# EAGLE design Multi-Channel-Thermocouple-Shield (EAGLE 6.3)
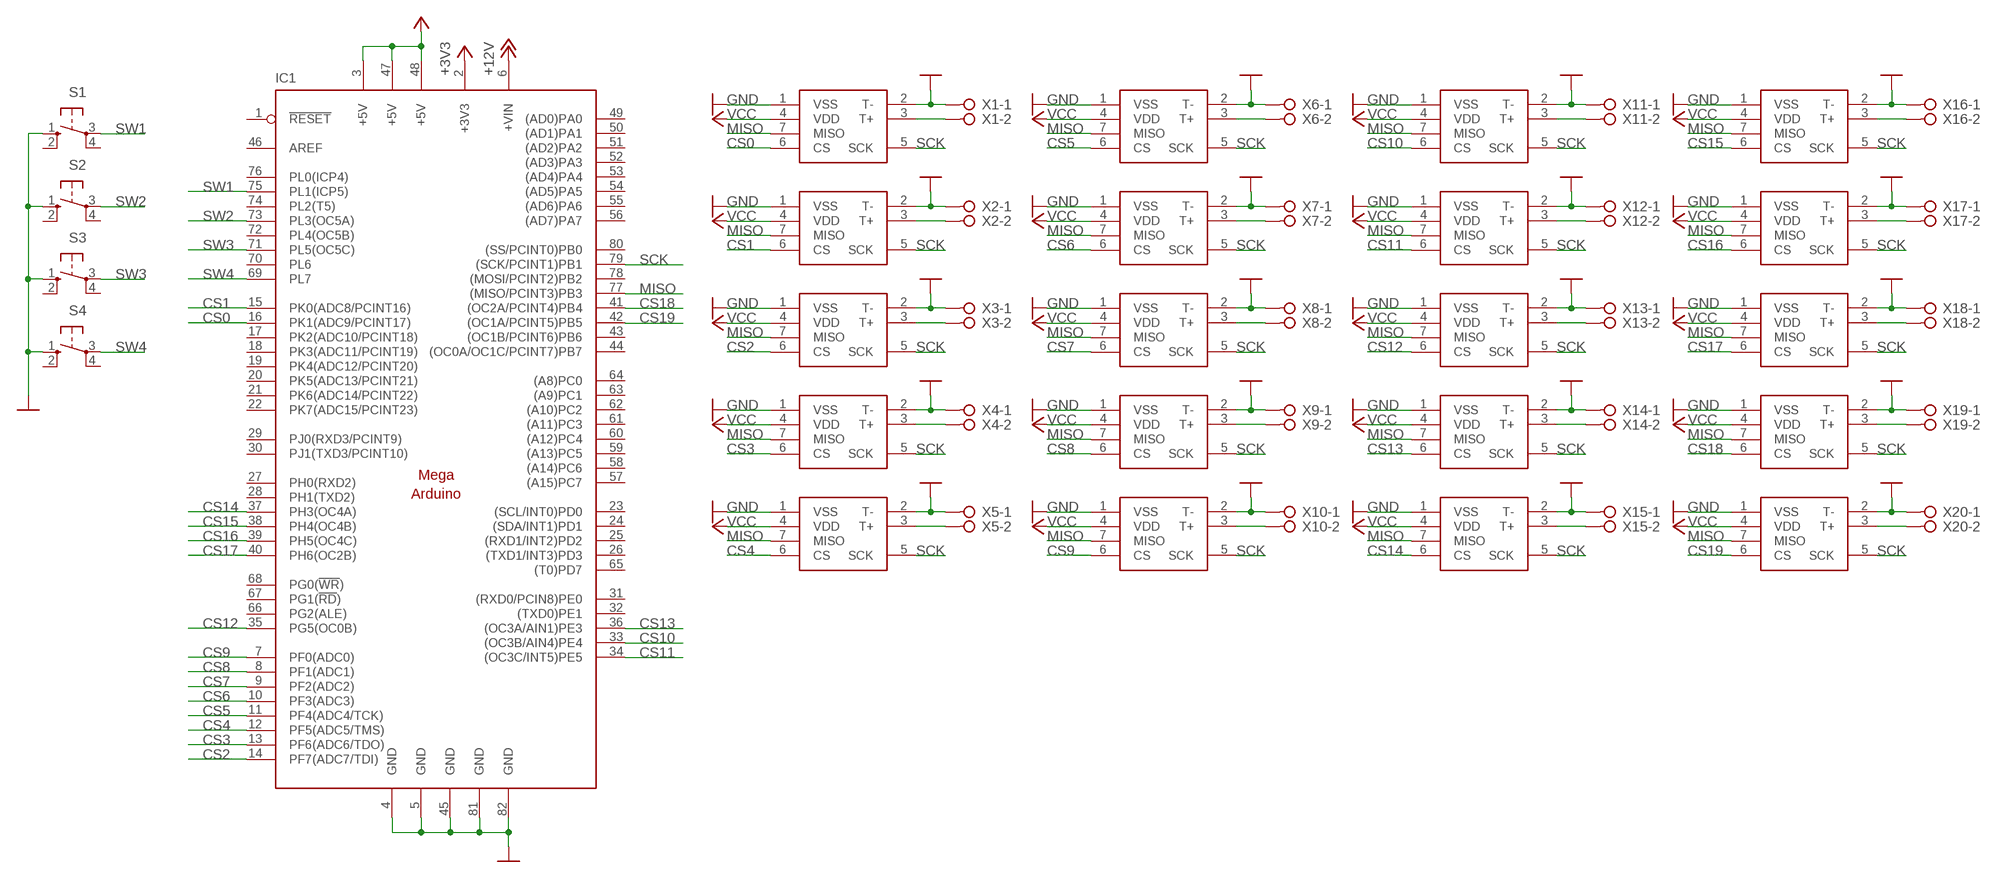
[diagram p0: schematic, sheet 1]

## Parts
IC1  ARDUINO_MEGA-SHIELD  [MEGA_ARDUINO]
S1  SW-PUSHBUTTON  [B3F-10XX]
S2  SW-PUSHBUTTON  [B3F-10XX]
S3  SW-PUSHBUTTON  [B3F-10XX]
S4  SW-PUSHBUTTON  [B3F-10XX]
U$1  MAX6675  [SO08]
U$2  MAX6675  [SO08]
U$3  MAX6675  [SO08]
U$4  MAX6675  [SO08]
U$5  MAX6675  [SO08]
U$6  MAX6675  [SO08]
U$7  MAX6675  [SO08]
U$8  MAX6675  [SO08]
U$9  MAX6675  [SO08]
U$10  MAX6675  [SO08]
U$11  MAX6675  [SO08]
U$12  MAX6675  [SO08]
U$13  MAX6675  [SO08]
U$14  MAX6675  [SO08]
U$15  MAX6675  [SO08]
U$16  MAX6675  [SO08]
U$17  MAX6675  [SO08]
U$18  MAX6675  [SO08]
U$19  MAX6675  [SO08]
U$20  MAX6675  [SO08]
X1  W237-02P  [W237-132]
X2  W237-02P  [W237-132]
X3  W237-02P  [W237-132]
X4  W237-02P  [W237-132]
X5  W237-02P  [W237-132]
X6  W237-02P  [W237-132]
X7  W237-02P  [W237-132]
X8  W237-02P  [W237-132]
X9  W237-02P  [W237-132]
X10  W237-02P  [W237-132]
X11  W237-02P  [W237-132]
X12  W237-02P  [W237-132]
X13  W237-02P  [W237-132]
X14  W237-02P  [W237-132]
X15  W237-02P  [W237-132]
X16  W237-02P  [W237-132]
X17  W237-02P  [W237-132]
X18  W237-02P  [W237-132]
X19  W237-02P  [W237-132]
X20  W237-02P  [W237-132]

## Nets
+3V3 [pwr]: IC1.2(+3V3)
+12V [pwr]: IC1.6(+VIN)
CS0: IC1.16(PK1(ADC9/PCINT17)) U$1.6(CS)
CS1: IC1.15(PK0(ADC8/PCINT16)) U$2.6(CS)
CS2: IC1.14(PF7(ADC7/TDI)) U$3.6(CS)
CS3: IC1.13(PF6(ADC6/TDO)) U$4.6(CS)
CS4: IC1.12(PF5(ADC5/TMS)) U$5.6(CS)
CS5: IC1.11(PF4(ADC4/TCK)) U$6.6(CS)
CS6: IC1.10(PF3(ADC3)) U$7.6(CS)
CS7: IC1.9(PF2(ADC2)) U$8.6(CS)
CS8: IC1.8(PF1(ADC1)) U$9.6(CS)
CS9: IC1.7(PF0(ADC0)) U$10.6(CS)
CS10: IC1.33((OC3B/AIN4)PE4) U$11.6(CS)
CS11: IC1.34((OC3C/INT5)PE5) U$12.6(CS)
CS12: IC1.35(PG5(OC0B)) U$13.6(CS)
CS13: IC1.36((OC3A/AIN1)PE3) U$14.6(CS)
CS14: IC1.37(PH3(OC4A)) U$15.6(CS)
CS15: IC1.38(PH4(OC4B)) U$16.6(CS)
CS16: IC1.39(PH5(OC4C)) U$17.6(CS)
CS17: IC1.40(PH6(OC2B)) U$18.6(CS)
CS18: IC1.41((OC2A/PCINT4)PB4) U$19.6(CS)
CS19: IC1.42((OC1A/PCINT5)PB5) U$20.6(CS)
GND [pwr]: IC1.4(GND) IC1.5(GND) IC1.45(GND) IC1.81(GND) IC1.82(GND) S1.1(S) S2.1(S) S3.1(S) S4.1(S) U$1.1(VSS) U$1.2(T-) U$2.1(VSS) U$2.2(T-) U$3.1(VSS) U$3.2(T-) U$4.1(VSS) U$4.2(T-) U$5.1(VSS) U$5.2(T-) U$6.1(VSS) U$6.2(T-) U$7.1(VSS) U$7.2(T-) U$8.1(VSS) U$8.2(T-) U$9.1(VSS) U$9.2(T-) U$10.1(VSS) U$10.2(T-) U$11.1(VSS) U$11.2(T-) U$12.1(VSS) U$12.2(T-) U$13.1(VSS) U$13.2(T-) U$14.1(VSS) U$14.2(T-) U$15.1(VSS) U$15.2(T-) U$16.1(VSS) U$16.2(T-) U$17.1(VSS) U$17.2(T-) U$18.1(VSS) U$18.2(T-) U$19.1(VSS) U$19.2(T-) U$20.1(VSS) U$20.2(T-) X1.1 X2.1 X3.1 X4.1 X5.1 X6.1 X7.1 X8.1 X9.1 X10.1 X11.1 X12.1 X13.1 X14.1 X15.1 X16.1 X17.1 X18.1 X19.1 X20.1
MISO: IC1.77((MISO/PCINT3)PB3) U$1.7(MISO) U$2.7(MISO) U$3.7(MISO) U$4.7(MISO) U$5.7(MISO) U$6.7(MISO) U$7.7(MISO) U$8.7(MISO) U$9.7(MISO) U$10.7(MISO) U$11.7(MISO) U$12.7(MISO) U$13.7(MISO) U$14.7(MISO) U$15.7(MISO) U$16.7(MISO) U$17.7(MISO) U$18.7(MISO) U$19.7(MISO) U$20.7(MISO)
N$2 [pwr]: U$10.3(T+) X10.2
N$4 [pwr]: U$1.3(T+) X1.2
N$6 [pwr]: U$2.3(T+) X2.2
N$7 [pwr]: U$3.3(T+) X3.2
N$11 [pwr]: U$4.3(T+) X4.2
N$13 [pwr]: U$5.3(T+) X5.2
N$14 [pwr]: U$6.3(T+) X6.2
N$17 [pwr]: U$7.3(T+) X7.2
N$18 [pwr]: U$8.3(T+) X8.2
N$21 [pwr]: U$9.3(T+) X9.2
N$23 [pwr]: U$11.3(T+) X11.2
N$25 [pwr]: U$12.3(T+) X12.2
N$27 [pwr]: U$13.3(T+) X13.2
N$29 [pwr]: U$14.3(T+) X14.2
N$31 [pwr]: U$15.3(T+) X15.2
N$34 [pwr]: U$16.3(T+) X16.2
N$36 [pwr]: U$17.3(T+) X17.2
N$38 [pwr]: U$18.3(T+) X18.2
N$39 [pwr]: U$19.3(T+) X19.2
N$42 [pwr]: U$20.3(T+) X20.2
SCK: IC1.79((SCK/PCINT1)PB1) U$1.5(SCK) U$2.5(SCK) U$3.5(SCK) U$4.5(SCK) U$5.5(SCK) U$6.5(SCK) U$7.5(SCK) U$8.5(SCK) U$9.5(SCK) U$10.5(SCK) U$11.5(SCK) U$12.5(SCK) U$13.5(SCK) U$14.5(SCK) U$15.5(SCK) U$16.5(SCK) U$17.5(SCK) U$18.5(SCK) U$19.5(SCK) U$20.5(SCK)
SW1: IC1.75(PL1(ICP5)) S1.3(P)
SW2: IC1.73(PL3(OC5A)) S2.3(P)
SW3: IC1.71(PL5(OC5C)) S3.3(P)
SW4: IC1.69(PL7) S4.3(P)
VCC [pwr]: IC1.3(+5V) IC1.47(+5V) IC1.48(+5V) U$1.4(VDD) U$2.4(VDD) U$3.4(VDD) U$4.4(VDD) U$5.4(VDD) U$6.4(VDD) U$7.4(VDD) U$8.4(VDD) U$9.4(VDD) U$10.4(VDD) U$11.4(VDD) U$12.4(VDD) U$13.4(VDD) U$14.4(VDD) U$15.4(VDD) U$16.4(VDD) U$17.4(VDD) U$18.4(VDD) U$19.4(VDD) U$20.4(VDD)
Unconnected: IC1.1(!RESET) IC1.17(PK2(ADC10/PCINT18)) IC1.18(PK3(ADC11/PCINT19)) IC1.19(PK4(ADC12/PCINT20)) IC1.20(PK5(ADC13/PCINT21)) IC1.21(PK6(ADC14/PCINT22)) IC1.22(PK7(ADC15/PCINT23)) IC1.23((SCL/INT0)PD0) IC1.24((SDA/INT1)PD1) IC1.25((RXD1/INT2)PD2) IC1.26((TXD1/INT3)PD3) IC1.27(PH0(RXD2)) IC1.28(PH1(TXD2)) IC1.29(PJ0(RXD3/PCINT9)) IC1.30(PJ1(TXD3/PCINT10)) IC1.31((RXD0/PCIN8)PE0) IC1.32((TXD0)PE1) IC1.43((OC1B/PCINT6)PB6) IC1.44((OC0A/OC1C/PCINT7)PB7) IC1.46(AREF) IC1.49((AD0)PA0) IC1.50((AD1)PA1) IC1.51((AD2)PA2) IC1.52((AD3)PA3) IC1.53((AD4)PA4) IC1.54((AD5)PA5) IC1.55((AD6)PA6) IC1.56((AD7)PA7) IC1.57((A15)PC7) IC1.58((A14)PC6) IC1.59((A13)PC5) IC1.60((A12)PC4) IC1.61((A11)PC3) IC1.62((A10)PC2) IC1.63((A9)PC1) IC1.64((A8)PC0) IC1.65((T0)PD7) IC1.66(PG2(ALE)) IC1.67(PG1(!RD!)) IC1.68(PG0(!WR!)) IC1.70(PL6) IC1.72(PL4(OC5B)) IC1.74(PL2(T5)) IC1.76(PL0(ICP4)) IC1.78((MOSI/PCINT2)PB2) IC1.80((SS/PCINT0)PB0) S1.2(S1) S1.4(P1) S2.2(S1) S2.4(P1) S3.2(S1) S3.4(P1) S4.2(S1) S4.4(P1)

## Library data of the parts
IC1 = barelang-store:ARDUINO_MEGA-SHIELD: The Arduino Mega is a microcontroller board based on the ATmega1280. - 54 digital input/output pins (of which 14 can be used as PWM outputs) - 16 analog inputs - 4 UARTs (hardware serial ports) - 16 MHz crystal oscillator - USB connection - power jack - ICSP header - reset button It contains everything needed to support the microcontroller; simply connect it to a computer with a USB cable or power it with a AC-to-DC adapter or battery to get started. The Mega is compatible with most shields designed for the Arduino Duemilanove or Diecimila. http://arduino.cc/en/Main/ArduinoBoardMega
S1-S4 = barelang-store:SW-PUSHBUTTON: OMRON SWITCH; MPN: B3F-1000; OC_FARNELL: 176432; OC_NEWARK: 36M3542
U$1-U$20 = max6675:MAX6675
X1-X20 = con-wago-508:W237-02P: WAGO SREW CLAMP; OC_FARNELL: unknown; OC_NEWARK: unknown

## Net classes
0 default: width 0.3 mm
1 pwr: width 0.5 mm

## Board
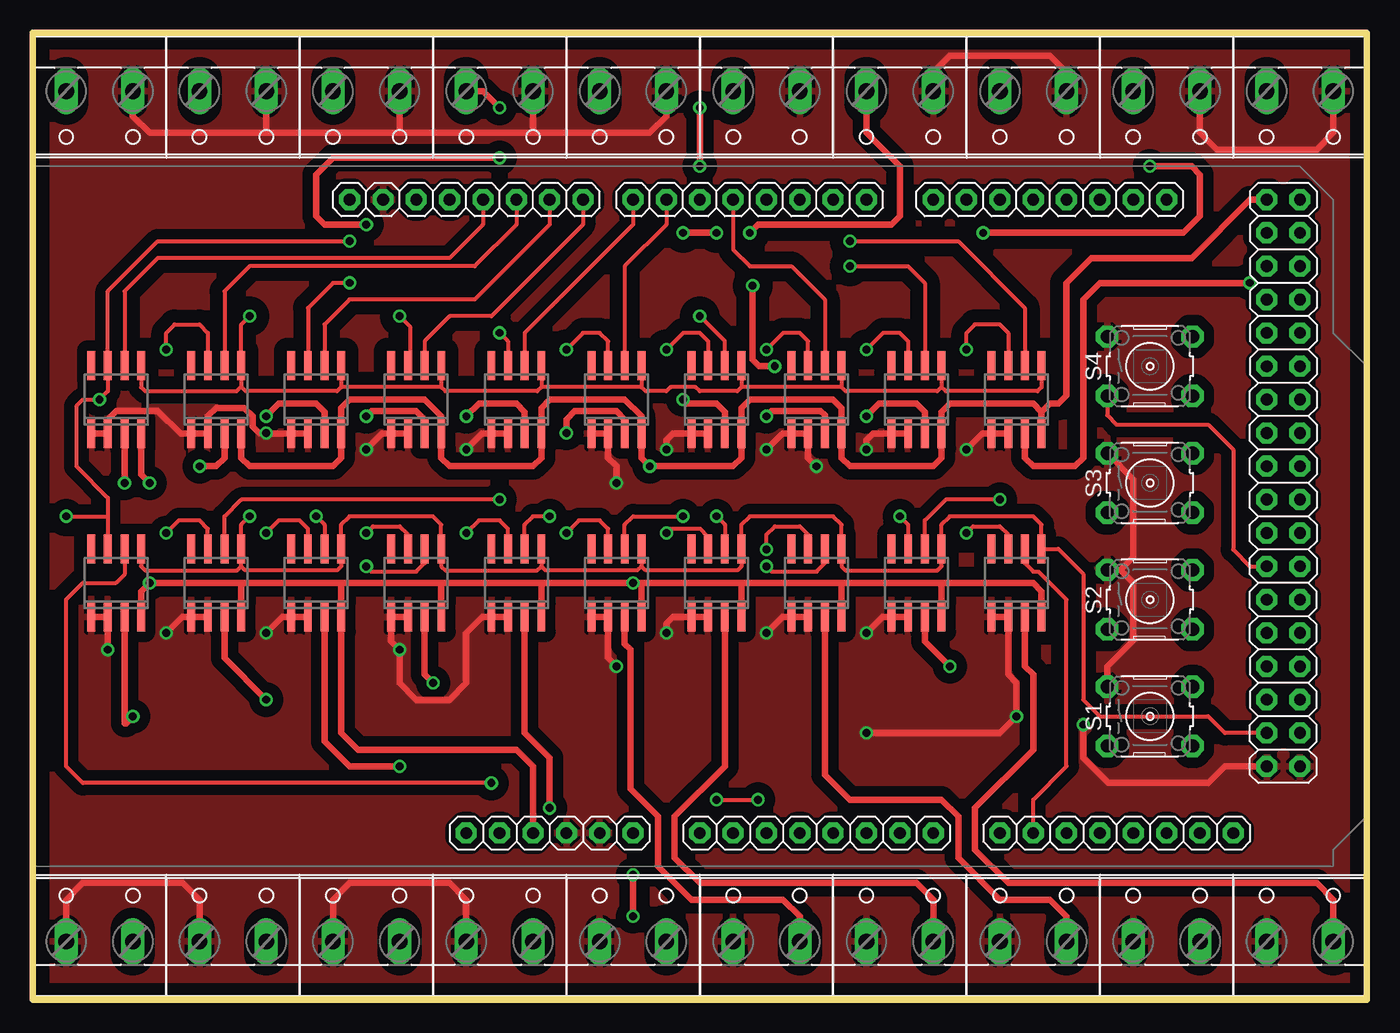
[diagram p1: board, top side]
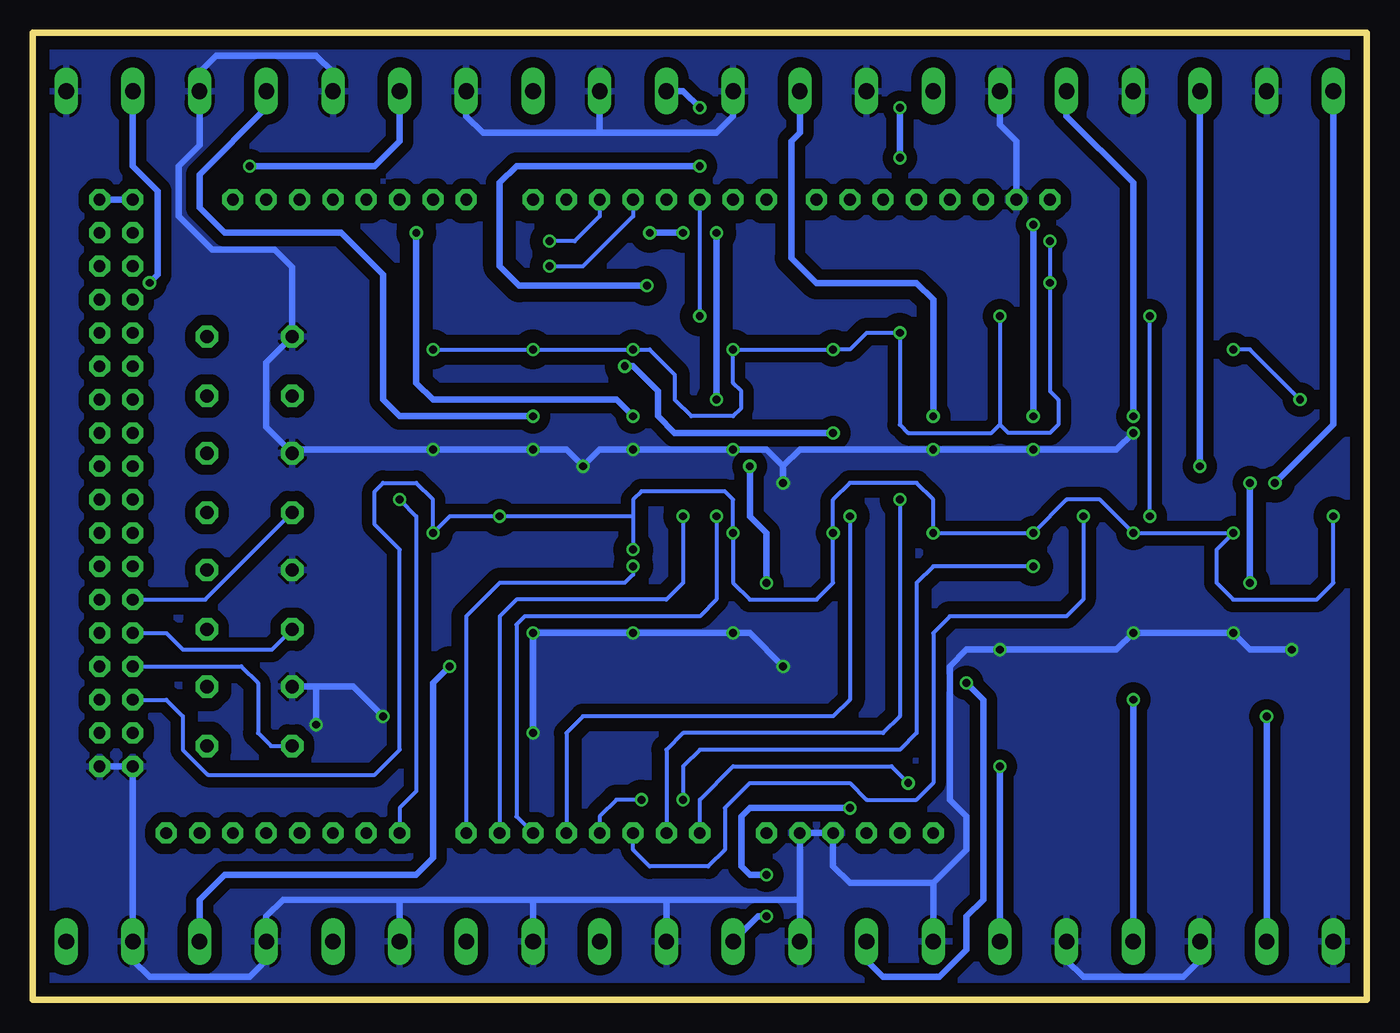
[diagram p2: board, bottom side, seen from below]

Size 101.6 x 73.66 mm. Coordinates in mm from the lower left corner, seen from the top.
Outline: 0,0 101.6,0 101.6,73.66 0,73.66 0,0
Copper layers (1*16): Top 0.035mm / dielectric 1.5mm / Bottom 0.035mm
Design rules "default *": minimum track width 10mil, minimum drill 0.6mm, track to track 10mil, track to pad 10mil, pad to pad 10mil, via to via 10mil, smd to smd 8mil, copper to edge 40mil, drill to drill 0.6mm, minimum pad ring 10mil, minimum via ring 8mil, stop-mask expansion 4mil, vias tented up to drill 0mil, thermal gap 10mil

### Footprints (pad centres in the part's own frame; a part is rotated, then mirrored left to right if it is on the bottom)
MEGA_ARDUINO = drill 0.9 pad 1.6 octagon: 1 33.02,2.54; 2 35.56,2.54; 3 38.1,2.54; 4 40.64,2.54; 5 43.18,2.54; 6 45.72,2.54; 7 50.8,2.54; 8 53.34,2.54; 9 55.88,2.54; 10 58.42,2.54; 11 60.96,2.54; 12 63.5,2.54; 13 66.04,2.54; 14 68.58,2.54; 15 73.66,2.54; 16 76.2,2.54; 17 78.74,2.54; 18 81.28,2.54; 19 83.82,2.54; 20 86.36,2.54; 21 88.9,2.54; 22 91.44,2.54; 23 86.36,50.8; 24 83.82,50.8; 25 81.28,50.8; 26 78.74,50.8; 27 76.2,50.8; 28 73.66,50.8; 29 71.12,50.8; 30 68.58,50.8; 31 63.5,50.8; 32 60.96,50.8; 33 58.42,50.8; 34 55.88,50.8; 35 53.34,50.8; 36 50.8,50.8; 37 48.26,50.8; 38 45.72,50.8; 39 41.91,50.8; 40 39.37,50.8; 41 36.83,50.8; 42 34.29,50.8; 43 31.75,50.8; 44 29.21,50.8; 45 26.67,50.8; 46 24.13,50.8; 47 93.98,50.8; 48 96.52,50.8; 49 93.98,48.26; 50 96.52,48.26; 51 93.98,45.72; 52 96.52,45.72; 53 93.98,43.18; 54 96.52,43.18; 55 93.98,40.64; 56 96.52,40.64; 57 93.98,38.1; 58 96.52,38.1; 59 93.98,35.56; 60 96.52,35.56; 61 93.98,33.02; 62 96.52,33.02; 63 93.98,30.48; 64 96.52,30.48; 65 93.98,27.94; 66 96.52,27.94; 67 93.98,25.4; 68 96.52,25.4; 69 93.98,22.86; 70 96.52,22.86; 71 93.98,20.32; 72 96.52,20.32; 73 93.98,17.78; 74 96.52,17.78; 75 93.98,15.24; 76 96.52,15.24; 77 93.98,12.7; 78 96.52,12.7; 79 93.98,10.16; 80 96.52,10.16; 81 93.98,7.62; 82 96.52,7.62
B3F-10XX = drill 1 pad 1.7 octagon: 1 -3.251,2.261; 2 3.251,2.261; 3 -3.251,-2.261; 4 3.251,-2.261
SO08 = smd 0.6 x 2.2: 1 -1.905,-2.6; 2 -0.635,-2.6; 3 0.635,-2.6; 4 1.905,-2.6; 5 1.905,2.6; 6 0.635,2.6; 7 -0.635,2.6; 8 -1.905,2.6
W237-132 = drill 1.194 long: 1 -2.54,-0.635; 2 2.54,-0.635

### Placement (x,y rotation side)
IC1  0,10.16 0 top
S1  85.09,21.59 0 top
S2  85.09,30.48 0 top
S3  85.09,39.37 0 top
S4  85.09,48.26 0 top
U$1  74.93,31.75 0 top
U$2  67.31,31.75 0 top
U$3  59.69,31.75 0 top
U$4  52.07,31.75 0 top
U$5  44.45,31.75 0 top
U$6  36.83,31.75 0 top
U$7  29.21,31.75 0 top
U$8  21.59,31.75 0 top
U$9  13.97,31.75 0 top
U$10  6.35,31.75 0 top
U$11  74.93,45.72 0 top
U$12  67.31,45.72 0 top
U$13  59.69,45.72 0 top
U$14  52.07,45.72 0 top
U$15  44.45,45.72 0 top
U$16  36.83,45.72 0 top
U$17  29.21,45.72 0 top
U$18  21.59,45.72 0 top
U$19  13.97,45.72 0 top
U$20  6.35,45.72 0 top
X1  96.52,5.08 0 top
X2  86.36,5.08 0 top
X3  76.2,5.08 0 top
X4  66.04,5.08 0 top
X5  55.88,5.08 0 top
X6  45.72,5.08 0 top
X7  35.56,5.08 0 top
X8  25.4,5.08 0 top
X9  15.24,5.08 0 top
X10  5.08,5.08 0 top
X11  96.52,68.58 180 top
X12  86.36,68.58 180 top
X13  76.2,68.58 180 top
X14  66.04,68.58 180 top
X15  55.88,68.58 180 top
X16  45.72,68.58 180 top
X17  35.56,68.58 180 top
X18  25.4,68.58 180 top
X19  15.24,68.58 180 top
X20  5.08,68.58 180 top

### Tracks (layer width: path | path; a pad name or v marks a point on that pad's centre or on a via)
CS0
  Top 0.3: U$1.6 75.56,33.26 76.2,32.62 76.59,32.62 78.74,30.48 78.74,17.78 76.2,15.24 IC1.16
CS1  (via drill 0.6 pad 1)
  Top 0.3: v73.66,38.1 69.53,38.1 67.94,36.51 U$2.6
  Bottom 0.3: v73.66,38.1 72.39,36.83 72.39,15.87 73.66,14.61 IC1.15
CS2  (via drill 0.6 pad 1)
  Top 0.3: v55.88,33.02 56.27,32.62 59.69,32.62 60.32,33.26 U$3.6
  Bottom 0.3: IC1.14 68.58,29.21 66.04,31.75 56.51,31.75 55.88,32.39 v55.88,33.02
CS3  (via drill 0.6 pad 1)
  Top 0.3: v52.07,36.83 52.71,36.2 U$4.6
  Bottom 0.3: v52.07,36.83 52.07,31.75 53.34,30.48 64.77,30.48 66.04,29.21 IC1.13
CS4  (via drill 0.6 pad 1)
  Top 0.3: U$5.6 45.09,36.2 45.72,36.83 v49.53,36.83
  Bottom 0.3: v49.53,36.83 49.53,30.48 50.8,29.21 64.13,29.21 64.77,28.57 64.77,13.97 IC1.12
CS5  (via drill 0.6 pad 1)
  Top 0.3: v39.37,36.83 38.1,36.83 37.47,36.2 U$6.6
  Bottom 0.3: v39.37,36.83 39.37,22.86 40.64,21.59 59.69,21.59 60.96,20.32 IC1.11
CS6  (via drill 0.6, 0.6 pad 1)
  Top 0.3: v25.4,33.02 25.8,32.62 29.21,32.62 29.84,33.26 U$7.6 | v52.07,15.24 v55.24,15.24
  Bottom 0.3: v25.4,33.02 33.02,33.02 34.29,31.75 34.29,20.32 35.56,19.05 50.8,19.05 52.07,17.78 v52.07,15.24 | v55.24,15.24 57.15,15.24 58.42,13.97 IC1.10
CS7  (via drill 0.6 pad 1)
  Top 0.3: v21.59,36.83 22.23,36.2 U$8.6
  Bottom 0.3: v21.59,36.83 21.59,30.48 22.86,29.21 31.75,29.21 33.02,27.94 33.02,16.51 34.29,15.24 38.1,15.24 39.37,16.51 46.99,16.51 48.9,14.61 48.9,11.43 50.16,10.16 54.61,10.16 55.88,11.43 IC1.9
CS8  (via drill 0.6 pad 1)
  Top 0.3: v35.56,38.1 15.88,38.1 14.61,36.83 U$9.6
  Bottom 0.3: v35.56,38.1 35.56,21.59 36.83,20.32 52.07,20.32 53.34,19.05 IC1.8
CS9  (via drill 0.6 pad 1)
  Top 0.3: v34.92,16.51 3.81,16.51 2.54,17.78 2.54,30.48 3.81,31.75 6.35,31.75 6.98,32.39 U$10.6
  Bottom 0.3: IC1.7 50.8,15.24 48.26,17.78 36.2,17.78 v34.92,16.51
CS10  (via drill 0.6 pad 1)
  Top 0.3: v62.23,57.78 70.49,57.78 75.56,52.7 U$11.6
  Bottom 0.3: IC1.33 58.42,59.69 60.32,57.78 v62.23,57.78
CS11  (via drill 0.6 pad 1)
  Top 0.3: U$12.6 67.94,54.61 66.68,55.88 v62.23,55.88
  Bottom 0.3: v62.23,55.88 59.69,55.88 55.88,59.69 IC1.34
CS12
  Top 0.3: U$13.6 60.32,53.34 57.79,55.88 54.61,55.88 53.34,57.15 IC1.35
CS13  (via drill 0.6 pad 1)
  Top 0.3: v50.8,52.07 52.71,50.17 U$14.6
  Bottom 0.3: v50.8,52.07 IC1.36
CS14
  Top 0.3: IC1.37 48.26,59.06 45.09,55.88 U$15.6
CS15
  Top 0.3: U$16.6 37.47,50.8 45.72,59.06 IC1.38
CS16
  Top 0.3: U$17.6 29.84,50.17 31.75,52.07 34.92,52.07 41.91,59.06 IC1.39
CS17
  Top 0.3: U$18.6 22.23,51.44 24.13,53.34 33.66,53.34 39.37,59.06 IC1.40
CS18
  Top 0.3: U$19.6 14.61,53.98 16.51,55.88 33.66,55.88 36.83,59.06 IC1.41
CS19
  Top 0.3: U$20.6 6.98,53.98 9.52,56.52 31.75,56.52 34.29,59.06 IC1.42
GND  (via drill 0.6, 0.6 pad 1)
  Top 0.5: 17.78,66.04 8.89,66.04 7.62,67.31 X20.1 | 17.78,66.04 X19.1 | 38.1,66.04 46.99,66.04 48.26,67.31 X16.1 | 38.1,66.04 27.94,66.04 | 27.94,66.04 17.78,66.04 | X18.1 27.94,66.04 | 38.1,66.04 X17.1 | S3.1 83.82,39.65 83.82,33.73 82.83,32.74 | v44.45,25.4 43.81,26.04 U$5.2 U$5.1 | S1.1 81.84,25.4 83.82,27.38 83.82,31.75 82.83,32.74 | v44.45,39.37 44.45,40.64 43.81,41.28 U$15.2 U$15.1 | v48.26,41.91 48.26,42.62 48.76,43.12 U$14.1 U$14.2 | X12.1 88.9,66.04 90.17,64.77 97.79,64.77 99.06,66.04 X11.1 | X7.1 33.02,7.62 31.75,8.89 24.13,8.89 22.86,7.62 X8.1 | X9.1 12.7,7.62 11.43,8.89 3.81,8.89 2.54,7.62 X10.1 | v63.5,20.32 73.66,20.32 v74.93,21.59 74.93,24.13 74.29,24.76 U$1.2 U$1.1 | v63.5,41.91 63.5,42.62 64,43.12 U$12.1 U$12.2 | v48.26,27.94 48.26,28.65 48.76,29.15 U$4.1 U$4.2 | v5.71,26.67 U$10.2 U$10.1 | U$20.1 U$20.2 5.71,44.21 6.35,44.84 9.52,44.84 11.25,43.12 U$19.1 U$19.2 13.34,44.45 13.97,45.09 16.09,45.09 16.73,44.45 16.73,43.68 17.23,43.18 v17.78,43.18 17.84,43.12 U$18.1 U$18.2 | U$17.2 U$17.1 26.61,43.12 v25.4,41.91 | U$16.2 U$16.1 34.23,43.12 v33.02,41.91 | v55.88,41.91 57.09,43.12 U$13.1 U$13.2 59.05,41.28 v59.69,40.64 | U$11.2 U$11.1 72.33,43.12 v71.12,41.91 | U$9.2 U$9.1 11.37,29.15 v10.16,27.94 | U$8.2 U$8.1 18.99,29.15 v17.78,27.94 | U$7.2 U$7.1 27.3,27.3 v27.94,26.67 27.94,24.13 29.21,22.86 31.75,22.86 33.02,24.13 33.02,27.94 34.23,29.15 U$6.1 U$6.2 | U$3.2 U$3.1 57.09,29.15 v55.88,27.94 | U$2.2 U$2.1 64.71,29.15 v63.5,27.94 | X14.1 68.58,70.64 69.85,71.91 77.47,71.91 78.74,70.64 X13.1 | S2.1 82.83,32.74 | IC1.81 90.81,17.78 89.53,16.51 81.91,16.51 80.01,18.41 v80.01,20.96
  Bottom 0.5: 73.66,7.62 82.55,7.62 83.82,6.35 X2.1 83.82,3.02 85.09,1.75 92.71,1.75 93.98,3.02 X1.1 IC1.81 IC1.82 | 73.66,7.62 X3.1 | 63.5,7.62 73.66,7.62 | 63.5,7.62 X4.1 | 43.18,7.62 53.34,7.62 | 53.34,7.62 63.5,7.62 | 53.34,7.62 X5.1 | 43.18,7.62 IC1.5 IC1.4 40.64,10.16 39.37,8.89 33.02,8.89 | 58.42,66.04 67.31,66.04 68.58,67.31 X14.1 | 58.42,66.04 49.53,66.04 48.26,67.31 X16.1 | 58.42,66.04 X15.1 | S1.1 80.01,23.85 | 80.01,23.85 77.19,23.85 v74.93,21.59 | v5.71,26.67 8.89,26.67 v10.16,27.94 v17.78,27.94 19.05,26.67 v27.94,26.67 30.48,26.67 31.75,25.4 31.75,15.24 30.48,13.97 30.48,11.43 33.02,8.89 | 43.18,7.62 X6.1 | v63.5,20.32 v63.5,27.94 v55.88,27.94 v48.26,27.94 46.99,27.94 v44.45,25.4 | 44.45,40.64 45.72,41.91 v48.26,41.91 v55.88,41.91 58.42,41.91 v59.69,40.64 60.96,41.91 v63.5,41.91 v71.12,41.91 81.56,41.91 S3.1 83.82,43.61 83.82,48.54 S4.1 81.84,55.8 83.19,57.15 87.95,57.15 90.49,59.69 90.49,63.5 88.9,65.09 X12.1 88.9,70.64 87.63,71.91 80.01,71.91 78.74,70.64 X13.1 | 44.45,40.64 v44.45,39.37 | v17.78,43.18 19.05,41.91 v25.4,41.91 v33.02,41.91 43.18,41.91 44.45,40.64 | X18.1 27.94,66.67 26.67,65.41 IC1.45 | 33.02,8.89 X7.1 | X9.1 12.7,3.02 13.97,1.75 21.59,1.75 22.86,3.02 X8.1 | v80.01,20.96 80.01,23.85
  pour Bottom (isolate 0.8): 0,0 101.6,0 101.6,73.66 0,73.66
  pour Top (isolate 0.8): 0,0 101.6,0 101.6,73.66 0,73.66
MISO  (via drill 0.6, 0.6 pad 1)
  Top 0.3: v2.54,36.83 5.71,36.83 | 5.71,36.83 5.71,38.23 3.31,40.64 3.31,45.22 3.81,45.72 v5.08,45.72 5.71,46.36 U$20.7 5.71,53.98 9.52,57.78 v24.13,57.78 | v24.13,54.61 22.86,54.61 20.95,52.7 U$18.7 | v66.04,36.83 66.68,36.2 U$2.7 | v10.16,49.53 10.16,50.8 10.8,51.44 12.7,51.44 13.34,50.8 U$19.7 | v71.12,49.53 71.12,50.8 71.75,51.44 73.66,51.44 74.29,50.8 U$11.7 | 5.71,36.83 U$10.7 | v27.94,52.07 28.73,51.28 28.73,48.32 U$17.7 | U$16.7 36.2,50.17 v35.56,50.8 | v25.4,35.56 25.91,36.06 27.94,36.06 28.58,35.43 U$7.7 | v71.12,35.56 71.62,36.06 73.66,36.06 74.29,35.43 U$1.7 | 48.59,49.86 v48.26,49.53 49.53,50.8 50.8,50.8 51.44,50.17 U$14.7 | 63.83,49.86 v63.5,49.53 64.77,50.8 66.04,50.8 66.68,50.17 U$12.7 | 33.35,35.89 v33.02,35.56 33.97,36.51 35.56,36.51 36.2,35.88 U$6.7 | v48.26,35.56 48.59,35.89 50.8,35.89 51.44,35.25 U$4.7 | U$15.7 43.81,50.17 43.18,50.8 41.91,50.8 v40.64,49.53 | U$13.7 59.05,50.17 58.42,50.8 57.15,50.8 v55.88,49.53 | U$8.7 20.95,35.88 20.32,36.51 18.73,36.51 v17.78,35.56 | U$9.7 13.34,35.88 12.7,36.51 11.11,36.51 v10.16,35.56 | U$5.7 43.81,35.88 43.18,36.51 41.59,36.51 v40.64,35.56 | v55.88,34.29 55.88,35.43 56.51,36.06 58.42,36.06 59.05,35.43 U$3.7
  Bottom 0.3: v24.13,57.78 v24.13,54.61 24.13,46.36 23.49,45.72 23.49,43.81 24.13,43.18 27.3,43.18 27.94,43.81 | v5.08,45.72 8.89,49.53 v10.16,49.53 | v71.12,49.53 v63.5,49.53 v55.88,49.53 54.61,49.53 52.71,47.62 52.71,45.72 51.44,44.45 48.26,44.45 47.62,45.09 47.62,46.36 48.26,46.99 v48.26,49.53 v40.64,49.53 39.37,49.53 38.1,50.8 v35.56,50.8 35.56,43.81 34.92,43.18 28.58,43.18 27.94,43.81 | 55.88,36.83 v66.04,36.83 69.85,36.83 v71.12,35.56 71.12,38.1 72.39,39.37 74.93,39.37 75.56,38.73 75.56,36.2 73.66,34.29 73.66,19.05 75.56,17.14 88.26,17.14 90.17,19.05 90.17,21.59 91.44,22.86 IC1.77 | v27.94,52.07 27.94,43.81 | v2.54,36.83 2.54,31.75 3.81,30.48 10.16,30.48 11.43,31.75 11.43,34.29 v10.16,35.56 v17.78,35.56 20.32,38.1 22.86,38.1 v25.4,35.56 v33.02,35.56 33.02,38.1 34.29,39.37 39.37,39.37 40.64,38.1 v40.64,35.56 40.64,31.75 41.91,30.48 46.99,30.48 48.26,31.75 v48.26,35.56 48.26,38.1 48.9,38.73 55.24,38.73 55.88,38.1 55.88,36.83 | 55.88,36.83 v55.88,34.29
N$1
  pour Bottom (isolate 1): 0,0 101.6,0 101.6,73.66 0,73.66
N$2  (via drill 0.6 pad 1)
  Top 0.5: v7.62,21.59 7.62,21.53 7.12,21.03 6.98,21.03 U$10.3
  Bottom 0.5: v7.62,21.59 X10.2
N$3
  pour Top (isolate 1): 0,0 101.6,0 101.6,73.66 0,73.66
N$4
  Top 0.5: X1.2 99.06,7.62 97.79,8.89 74.29,8.89 71.75,11.43 71.75,14.61 76.2,19.05 76.2,24.76 75.56,25.4 U$1.3
N$6  (via drill 0.6 pad 1)
  Top 0.5: v69.85,25.4 67.94,27.3 U$2.3
  Bottom 0.5: X2.2 88.9,7.62 87,9.53 72.39,9.53 71.12,10.79 71.12,24.13 v69.85,25.4
N$7
  Top 0.5: U$3.3 60.32,17.14 62.23,15.24 69.22,15.24 70.49,13.97 70.49,10.79 73.66,7.62 77.47,7.62 78.74,6.35 X3.2
N$11
  Top 0.5: X4.2 68.58,7.62 67.31,8.89 50.8,8.89 48.9,10.79 48.9,13.97 52.71,17.78 U$4.3
N$13
  Top 0.5: U$5.3 45.09,27.11 45.53,26.67 45.53,16.07 47.62,13.97 47.62,10.16 50.16,7.62 57.15,7.62 58.42,6.35 X5.2
N$14  (via drill 0.6, 0.6 pad 1)
  Top 0.5: U$6.3 37.47,20.32 39.37,18.41 v39.37,14.61 | v45.72,9.53 v45.72,6.35
  Bottom 0.5: v45.72,6.35 46.35,6.35 X6.2 | v39.37,14.61 46.99,14.61 47.62,13.97 47.62,10.16 46.99,9.53 v45.72,9.53
N$17  (via drill 0.6 pad 1)
  Top 0.5: v30.48,24.13 29.84,24.76 U$7.3
  Bottom 0.5: v30.48,24.13 29.21,22.86 29.21,7.62 30.48,6.35 30.48,3.81 32.54,1.75 36.83,1.75 38.1,3.02 X7.2
N$18  (via drill 0.6 pad 1)
  Top 0.5: v27.94,17.78 24.13,17.78 22.23,19.68 U$8.3
  Bottom 0.5: v27.94,17.78 X8.2
N$21  (via drill 0.6 pad 1)
  Top 0.5: U$9.3 14.61,26.04 v17.78,22.86
  Bottom 0.5: v17.78,22.86 X9.2
N$23  (via drill 0.6 pad 1)
  Top 0.5: v92.71,54.61 81.28,54.61 80.01,53.34 80.01,41.28 79.38,40.64 76.2,40.64 75.56,41.28 U$11.3
  Bottom 0.5: X11.2 93.98,63.5 92.07,61.59 92.07,55.25 v92.71,54.61
N$25  (via drill 0.6 pad 1)
  Top 0.5: v63.5,44.45 64.45,45.4 67.31,45.4 67.94,44.77 U$12.3
  Bottom 0.5: v63.5,44.45 73.66,44.45 74.93,45.72 74.93,55.25 78.1,58.42 87,58.42 88.9,60.33 88.9,62.87 83.82,67.95 X12.2
N$27  (via drill 0.6, 0.6 pad 1)
  Top 0.5: v55.88,44.45 56.27,44.84 60.01,44.84 60.32,44.53 U$13.3 | v85.09,63.5 88.26,63.5 88.9,62.87 88.9,59.69 87.63,58.42 v72.39,58.42
  Bottom 0.5: v55.88,44.45 57.15,45.72 71.12,45.72 72.39,46.99 v72.39,58.42 | X13.2 73.66,65.41 75.56,63.5 v85.09,63.5
N$29  (via drill 0.6, 0.6 pad 1)
  Top 0.5: U$14.3 52.71,44.77 52.07,45.4 49.85,45.4 v49.53,45.72 | X14.2 63.5,66.04 66.04,63.5 66.04,59.69 65.41,59.06 55.24,59.06 v54.61,58.42 | v52.07,58.42 v49.53,58.42
  Bottom 0.5: v49.53,45.72 v49.53,58.42 | v54.61,58.42 v52.07,58.42
N$31  (via drill 0.6, 0.6 pad 1)
  Top 0.5: v54.83,54.39 54.83,48.76 55.33,48.26 v56.51,48.26 | v40.64,43.18 40.64,44.21 41.27,44.84 44.45,44.84 45.09,44.21 U$15.3 | v50.8,63.5 v50.8,67.95
  Bottom 0.5: v40.64,43.18 52.71,43.18 53.98,44.45 53.98,46.36 55.88,48.26 v56.51,48.26 | X15.2 52.07,69.22 v50.8,67.95 | v54.83,54.39 64.55,54.39 66.04,55.88 66.04,62.23 64.77,63.5 v50.8,63.5
N$34  (via drill 0.6 pad 1)
  Top 0.5: v33.02,44.45 33.97,45.4 36.83,45.4 37.47,44.77 U$16.3
  Bottom 0.5: v33.02,44.45 33.02,53.34 34.29,54.61 41.91,54.61 43.81,56.52 43.81,65.41 43.18,66.04 X16.2
N$36  (via drill 0.6, 0.6 pad 1)
  Top 0.5: v25.4,44.45 25.8,44.84 29.21,44.84 29.84,44.21 U$17.3 | v25.4,59.06 22.23,59.06 21.59,59.69 21.59,62.87 22.86,64.14 v35.56,64.14 | v35.56,67.95 34.29,69.22 X17.2
  Bottom 0.5: v25.4,44.45 v25.4,59.06 | v35.56,64.14 v35.56,67.95
N$38  (via drill 0.6 pad 1)
  Top 0.5: v17.78,44.45 18.73,45.4 21.59,45.4 22.23,44.77 U$18.3
  Bottom 0.5: X18.2 22.86,67.31 17.78,62.23 v17.78,44.45
N$39  (via drill 0.6 pad 1)
  Top 0.5: v12.7,40.64 13.97,40.64 14.61,41.28 U$19.3
  Bottom 0.5: v12.7,40.64 X19.2
N$42  (via drill 0.6 pad 1)
  Top 0.5: v6.98,39.37 U$20.3
  Bottom 0.5: v6.98,39.37 2.54,43.81 X20.2
SCK  (via drill 0.6 pad 1)
  Top 0.3: v16.51,52.07 15.88,51.44 U$19.5 15.88,46.7 | v16.51,36.83 15.88,36.2 U$9.5 15.88,33.02 | IC1.79 90.81,20.32 89.53,21.59 81.28,21.59 80.01,22.86 80.01,32.44 78.1,34.35 U$1.5 76.84,36.2 76.2,36.83 69.85,36.83 69.22,36.2 U$2.5 69.22,33.02 68.9,32.7 61.91,32.7 61.6,33.02 U$3.5 61.6,36.2 60.96,36.83 54.61,36.83 53.98,36.2 U$4.5 53.98,33.02 53.66,32.7 46.67,32.7 46.35,33.02 | U$20.5 8.25,46.67 8.57,46.36 15.52,46.36 15.88,46.7 | U$18.5 23.49,46.67 | 23.49,46.67 23.18,46.36 16.23,46.36 15.88,46.7 | U$17.5 31.12,46.67 | 31.12,46.67 23.49,46.67 | U$16.5 38.73,46.67 | 38.73,46.67 38.42,46.36 31.43,46.36 31.12,46.67 | U$15.5 46.35,46.67 | 46.35,46.67 38.73,46.67 | U$14.5 53.98,46.67 | 53.98,46.67 53.66,46.36 50.8,46.36 50.48,46.67 48.58,46.67 48.26,46.36 46.67,46.36 46.35,46.67 | U$13.5 61.6,46.67 | 61.6,46.67 53.98,46.67 | U$12.5 69.22,46.67 | 69.22,46.67 68.9,46.36 61.91,46.36 61.6,46.67 | U$11.5 76.84,46.67 76.52,46.36 69.53,46.36 69.22,46.67 | U$10.5 8.25,33.02 8.57,32.7 15.56,32.7 15.88,33.02 | 15.88,33.02 16.19,32.7 23.18,32.7 23.49,33.02 U$8.5 23.49,36.2 24.13,36.83 30.48,36.83 31.12,36.2 U$7.5 31.12,33.02 31.43,32.7 38.42,32.7 38.73,33.02 | U$6.5 38.73,33.02 | U$5.5 46.35,33.02 | 46.35,33.02 46.04,32.7 39.05,32.7 38.73,33.02
  Bottom 0.3: v16.51,36.83 v16.51,52.07
SW1
  Bottom 0.3: IC1.75 85.72,25.4 84.46,24.13 84.46,20.32 83.46,19.33 S1.3
SW2
  Bottom 0.3: S2.3 83.39,26.67 90.17,26.67 91.44,27.94 IC1.73
SW3
  Bottom 0.3: IC1.71 88.47,30.48 S3.3
SW4
  Top 0.3: S4.3 81.84,44.53 82.55,43.81 89.53,43.81 91.44,41.91 91.44,34.29 92.71,33.02 IC1.69
VCC  (via drill 0.6 pad 1)
  Top 0.5: 61.6,31.75 69.22,31.75 | 69.22,31.75 76.2,31.75 76.84,31.11 U$1.4 | 69.22,31.75 U$2.4 | 61.6,31.75 53.98,31.75 | 53.98,31.75 46.35,31.75 | 38.73,31.75 v45.72,31.75 46.35,31.75 | 38.73,31.75 31.12,31.75 | 31.12,31.75 23.49,31.75 | 23.49,31.75 15.88,31.75 | 23.49,31.75 U$8.4 23.49,20.32 24.77,19.05 36.83,19.05 38.1,17.78 IC1.3 | 31.12,31.75 U$7.4 | v8.89,31.75 8.64,31.5 | 61.6,31.75 U$3.4 | 38.73,31.75 U$6.4 | 53.98,31.75 U$4.4 | v8.89,31.75 15.88,31.75 | U$20.4 8.25,40 v8.89,39.37 | U$19.4 15.88,41.28 16.51,40.64 22.86,40.64 23.49,41.28 U$18.4 23.49,45.09 24.13,45.72 29.84,45.72 31.12,44.45 U$17.4 31.12,41.28 31.75,40.64 38.1,40.64 38.73,41.28 U$16.4 38.73,45.09 39.37,45.72 45.09,45.72 46.35,44.45 U$15.4 46.35,41.28 v46.99,40.64 53.34,40.64 53.98,41.28 U$14.4 53.98,45.09 54.61,45.72 60.96,45.72 61.6,45.09 U$13.4 61.6,41.28 62.23,40.64 68.58,40.64 69.22,41.28 U$12.4 69.22,44.77 69.85,45.4 76.2,45.4 76.84,44.77 | U$10.4 8.25,31.11 v8.89,31.75 | U$9.4 15.88,31.75 | U$5.4 46.35,31.75 | IC1.47 92.71,60.96 88.26,56.52 80.65,56.52 78.74,54.61 78.74,46.04 78.1,45.4 77.47,45.4 76.84,44.77 | 76.84,44.77 U$11.4
  Bottom 0.5: v8.89,31.75 v8.89,39.37 | IC1.47 IC1.48 | v46.99,40.64 46.99,36.83 45.72,35.56 v45.72,31.75